# Altium schematic sheet MOSFETs_V2.SchDoc
size A4; SheetNumber: 2; SheetTotal: 4
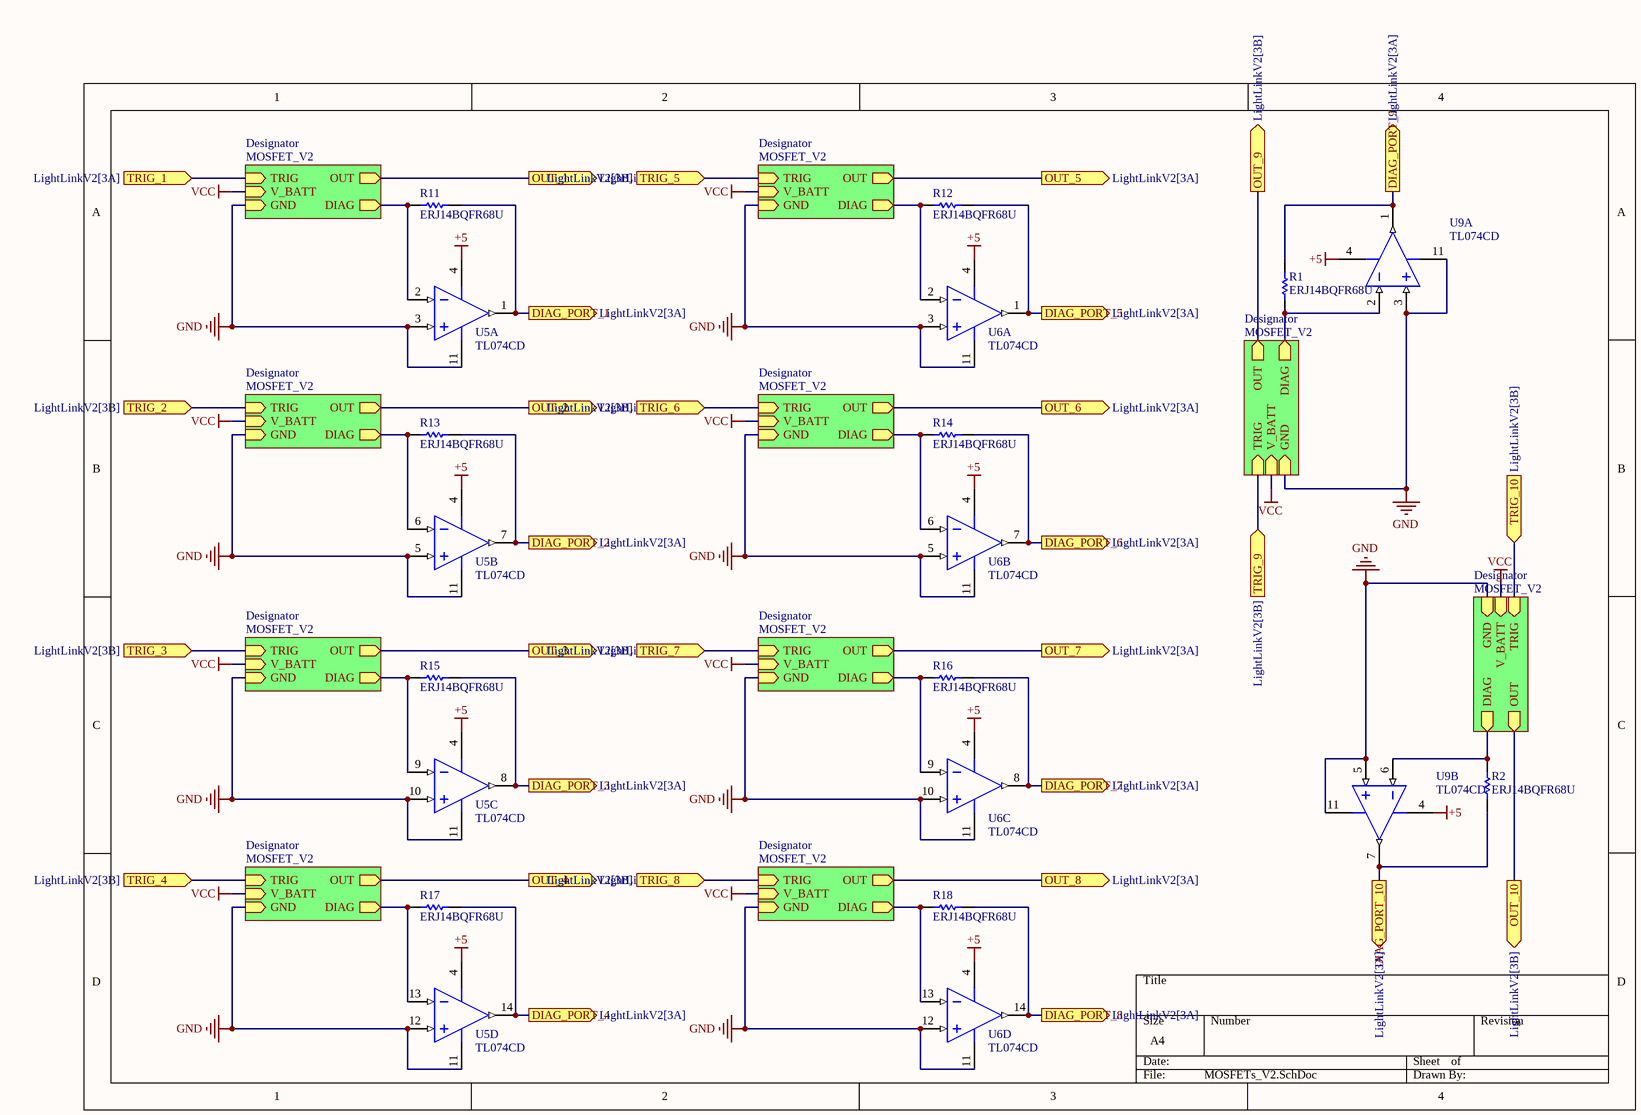
[diagram p0: MOSFETs_V2.SchDoc]

## Parts
R1  ERJ14BQFR68U  [RESC3225X70X50LL20T20]
R2  ERJ14BQFR68U  [RESC3225X70X50LL20T20]
R11  ERJ14BQFR68U  [RESC3225X70X50LL20T20]
R12  ERJ14BQFR68U  [RESC3225X70X50LL20T20]
R13  ERJ14BQFR68U  [RESC3225X70X50LL20T20]
R14  ERJ14BQFR68U  [RESC3225X70X50LL20T20]
R15  ERJ14BQFR68U  [RESC3225X70X50LL20T20]
R16  ERJ14BQFR68U  [RESC3225X70X50LL20T20]
R17  ERJ14BQFR68U  [RESC3225X70X50LL20T20]
R18  ERJ14BQFR68U  [RESC3225X70X50LL20T20]
U5  TL074CD  [D0014A_M]  (parts A,B,C,D of 4)
U6  TL074CD  [D0014A_M]  (parts A,B,C,D of 4)
U9  TL074CD  [D0014A_M]  (parts A,B of 4)

## Sub-sheets
Designator = MOSFET_V2: TRIG (in), V_BATT (in), OUT (out), DIAG (out), GND (in)
Designator = MOSFET_V2: TRIG (in), V_BATT (in), OUT (out), DIAG (out), GND (in)
Designator = MOSFET_V2: TRIG (in), V_BATT (in), OUT (out), DIAG (out), GND (in)
Designator = MOSFET_V2: TRIG (in), V_BATT (in), OUT (out), DIAG (out), GND (in)
Designator = MOSFET_V2: TRIG (in), V_BATT (in), OUT (out), DIAG (out), GND (in)
Designator = MOSFET_V2: TRIG (in), V_BATT (in), OUT (out), DIAG (out), GND (in)
Designator = MOSFET_V2: TRIG (in), V_BATT (in), OUT (out), DIAG (out), GND (in)
Designator = MOSFET_V2: TRIG (in), V_BATT (in), OUT (out), DIAG (out), GND (in)
Designator = MOSFET_V2: TRIG (in), V_BATT (in), OUT (out), DIAG (out), GND (in)
Designator = MOSFET_V2: TRIG (in), V_BATT (in), OUT (out), DIAG (out), GND (in)

## Ports
DIAG_PORT_1 (out, see LightLinkV2[3A]), DIAG_PORT_2 (out, see LightLinkV2[3A]), DIAG_PORT_3 (out, see LightLinkV2[3A]), DIAG_PORT_4 (out, see LightLinkV2[3A]), DIAG_PORT_5 (out, see LightLinkV2[3A]), DIAG_PORT_6 (out, see LightLinkV2[3A]), DIAG_PORT_7 (out, see LightLinkV2[3A]), DIAG_PORT_8 (out, see LightLinkV2[3A]), DIAG_PORT_9 (out, see LightLinkV2[3A]), DIAG_PORT_10 (out, see LightLinkV2[3A]), OUT_1 (out, see LightLinkV2[3A]), OUT_2 (out, see LightLinkV2[3A]), OUT_3 (out, see LightLinkV2[3A]), OUT_4 (out, see LightLinkV2[3A]), OUT_5 (out, see LightLinkV2[3A]), OUT_6 (out, see LightLinkV2[3A]), OUT_7 (out, see LightLinkV2[3A]), OUT_8 (out, see LightLinkV2[3A]), OUT_9 (out, see LightLinkV2[3B]), OUT_10 (out, see LightLinkV2[3B]), TRIG_1 (in, see LightLinkV2[3A]), TRIG_2 (in, see LightLinkV2[3B]), TRIG_3 (in, see LightLinkV2[3B]), TRIG_4 (in, see LightLinkV2[3B]), TRIG_5 (in, see LightLinkV2[3B]), TRIG_6 (in, see LightLinkV2[3B]), TRIG_7 (in, see LightLinkV2[3B]), TRIG_8 (in, see LightLinkV2[3B]), TRIG_9 (in, see LightLinkV2[3B]), TRIG_10 (in, see LightLinkV2[3B])

## Nets
+5: U5.4(VCC+) U6.4(VCC+) U9.4(VCC+)
GND: U5.3(IN1+) U5.5(IN2+) U5.10(IN3+) U5.11(VCC-) U5.12(IN4+) U6.3(IN1+) U6.5(IN2+) U6.10(IN3+) U6.11(VCC-) U6.12(IN4+) U9.3(IN1+) U9.5(IN2+) U9.11(VCC-) ; sheet Designator/GND, sheet Designator/GND, sheet Designator/GND, sheet Designator/GND, sheet Designator/GND, sheet Designator/GND, sheet Designator/GND, sheet Designator/GND, sheet Designator/GND, sheet Designator/GND
VCC: sheet Designator/V_BATT, sheet Designator/V_BATT, sheet Designator/V_BATT, sheet Designator/V_BATT, sheet Designator/V_BATT, sheet Designator/V_BATT, sheet Designator/V_BATT, sheet Designator/V_BATT, sheet Designator/V_BATT, sheet Designator/V_BATT
DIAG_PORT_1: R11.2 U5.1(OUT1) ; port DIAG_PORT_1
DIAG_PORT_2: R13.2 U5.7(OUT2) ; port DIAG_PORT_2
DIAG_PORT_3: R15.2 U5.8(OUT3) ; port DIAG_PORT_3
DIAG_PORT_4: R17.2 U5.14(OUT4) ; port DIAG_PORT_4
DIAG_PORT_5: R12.2 U6.1(OUT1) ; port DIAG_PORT_5
DIAG_PORT_6: R14.2 U6.7(OUT2) ; port DIAG_PORT_6
DIAG_PORT_7: R16.2 U6.8(OUT3) ; port DIAG_PORT_7
DIAG_PORT_8: R18.2 U6.14(OUT4) ; port DIAG_PORT_8
DIAG_PORT_9: R1.2 U9.1(OUT1) ; port DIAG_PORT_9
DIAG_PORT_10: R2.2 U9.7(OUT2) ; port DIAG_PORT_10
OUT_1: port OUT_1, sheet Designator/OUT
OUT_2: port OUT_2, sheet Designator/OUT
OUT_3: port OUT_3, sheet Designator/OUT
OUT_4: port OUT_4, sheet Designator/OUT
OUT_5: port OUT_5, sheet Designator/OUT
OUT_6: port OUT_6, sheet Designator/OUT
OUT_7: port OUT_7, sheet Designator/OUT
OUT_8: port OUT_8, sheet Designator/OUT
OUT_9: port OUT_9, sheet Designator/OUT
OUT_10: port OUT_10, sheet Designator/OUT
TRIG_1: port TRIG_1, sheet Designator/TRIG
TRIG_2: port TRIG_2, sheet Designator/TRIG
TRIG_3: port TRIG_3, sheet Designator/TRIG
TRIG_4: port TRIG_4, sheet Designator/TRIG
TRIG_5: port TRIG_5, sheet Designator/TRIG
TRIG_6: port TRIG_6, sheet Designator/TRIG
TRIG_7: port TRIG_7, sheet Designator/TRIG
TRIG_8: port TRIG_8, sheet Designator/TRIG
TRIG_9: port TRIG_9, sheet Designator/TRIG
TRIG_10: port TRIG_10, sheet Designator/TRIG
NetR1_1: R1.1 U9.2(IN1-) ; sheet Designator/DIAG
NetR2_1: R2.1 U9.6(IN2-) ; sheet Designator/DIAG
NetR11_1: R11.1 U5.2(IN1-) ; sheet Designator/DIAG
NetR12_1: R12.1 U6.2(IN1-) ; sheet Designator/DIAG
NetR13_1: R13.1 U5.6(IN2-) ; sheet Designator/DIAG
NetR14_1: R14.1 U6.6(IN2-) ; sheet Designator/DIAG
NetR15_1: R15.1 U5.9(IN3-) ; sheet Designator/DIAG
NetR16_1: R16.1 U6.9(IN3-) ; sheet Designator/DIAG
NetR17_1: R17.1 U5.13(IN4-) ; sheet Designator/DIAG
NetR18_1: R18.1 U6.13(IN4-) ; sheet Designator/DIAG

## Library data of the parts
R1 R2 R11-R18 = CMP-2005-03807-1: Manufacturer: Panasonic; Part Number: ERJ14BQFR68U
U5 U6 U9 = CMP-0017-00005-2: Quad Low-Noise JFET-Input General-Purpose Operational Amplifier, 7 to 36 V, 0 to 70 degC, 14-pin SOIC (D14), Green (RoHS & no Sb/Br); Manufacturer: Texas Instruments; Iq per channel(Max)(mA): 2.5; CMRR(Min)(dB): 70; Offset Drift(Typ)(uV/C): 18; Slew Rate(Typ)(V/us): 13; Rating: Military; Number of Channels: 4; Total Supply Voltage(Min)(+5V is 5, +/-5V is 10): 7; Sub Family: General Purpose Amplifier, High Supply Voltage Amplifier (>=30V); IIB(Max)(pA): 200; Total Supply Voltage(Max)(+5V is 5, +/-5V is 10): 36; Vio (25C)(Max)(mV): 10; GBW(Typ)(MHz): 3; ComponentLink1Description: Manufacturer URL; ComponentLink2Description: Datasheet; PackageDescription: 14-Pin Plastic Small Outline, Body 8.65 x 3.90 mm, Pitch 1.27 mm; Mounting Technology: Surface Mount; ComponentLink2URL: http://www.ti.com/lit/ds/symlink/tl074.pdf; PartNumber: TL074CD; Vn at 1kHz(Typ)(nV/rtHz): 18; Eco-Plan: Green (RoHS & no Sb/Br); ComponentLink1URL: http://www.ti.com/; PackageVersion: 4040047-5/M, 06/2011; ComponentLink3Description: Package Specification; DatasheetVersion: SLOS080J; Code_JEDEC: MS-012; PackageReference: D0014A; ComponentLink3URL: http://www.ti.com/lit/ml/mpds177g/mpds177g.pdf